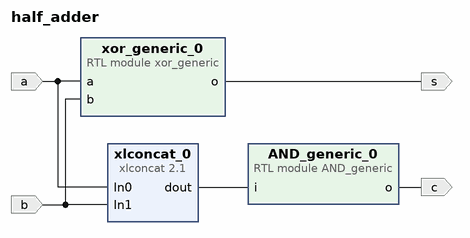
[diagram p0: block diagram of the top level]
# Vivado block design half_adder, xc7z020clg400-1, Vivado 2023.2
create_bd_design half_adder

create_bd_port -dir I a
create_bd_port -dir I b
create_bd_port -dir O s
create_bd_port -dir O c

create_bd_cell -type module -reference AND_generic AND_generic_0
set_property -dict {CONFIG.n_inputs 2} [get_bd_cells AND_generic_0]
create_bd_cell -type module -reference xor_generic xor_generic_0
create_bd_cell -type ip -vlnv xilinx.com:ip:xlconcat:2.1 xlconcat_0

# ---- connections ----

connect_bd_net [get_bd_pins AND_generic_0/o] [get_bd_ports c]
connect_bd_net [get_bd_ports a] [get_bd_pins xlconcat_0/In0] [get_bd_pins xor_generic_0/a]
connect_bd_net [get_bd_ports b] [get_bd_pins xlconcat_0/In1] [get_bd_pins xor_generic_0/b]
connect_bd_net [get_bd_pins xlconcat_0/dout] [get_bd_pins AND_generic_0/i]
connect_bd_net [get_bd_pins xor_generic_0/o] [get_bd_ports s]

validate_bd_design
save_bd_design
